# EasyEDA Pro project MPU_6050_Adapter.eprj

# Schematic Schematic1
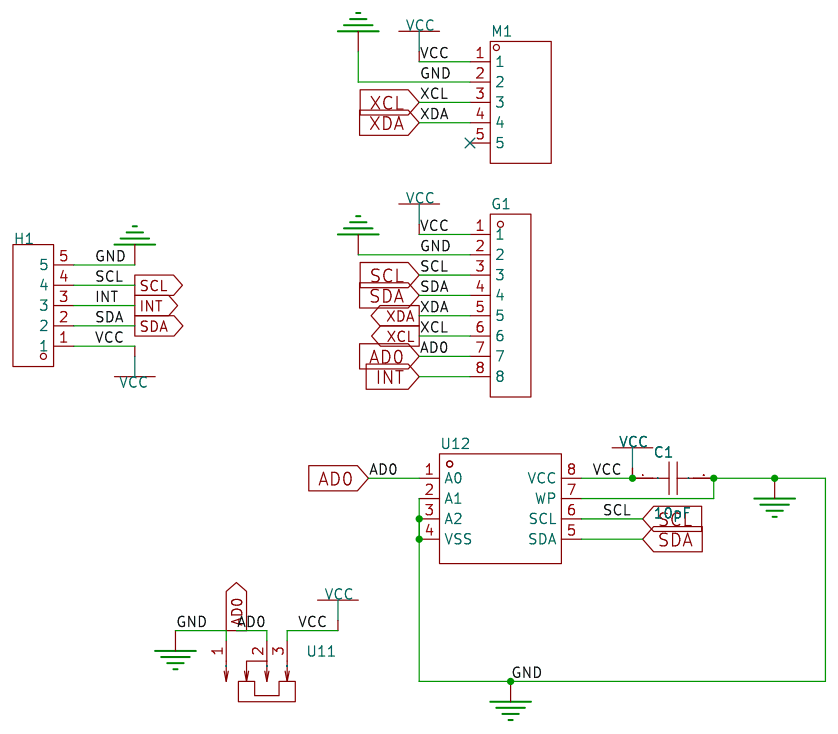
[diagram p0: schematic sheet]

## Parts
C1  10pF  [C0402]
G1  -  [MPU6050]
H1  -  [HDR-TH_5P-P2.54-V-M]
M1  -  [GY-271]  (no BOM)
U11  -  [SW-TH_SK-3260D-01-LX]
U12  -  [SOIC-8_L4.9-W3.9-P1.27-LS6.0-BL]

## Library data of the parts
C1 = CL05C100JB5NNNC: Capacitance: Tolerance: Tolerance: Voltage Rated: Temperature Coefficient:; LCSC Part Name: 10pF ±5% 50V; Supplier Part: C32949; Manufacturer: SAMSUNG(三星); Supplier Footprint: 0402; JLCPCB Part Class: Basic Part; Datasheet: https://atta.szlcsc.com/upload/public/pdf/source/20160103/1457707722238.pdf; Supplier: LCSC
G1 = MPU6050
H1 = PZ254V-11-05P: Pitch:2.54mm Number of Pins:5 Number of Rows:1 Pin Structure:1x5P Row Spacing:- Mounting Type:直插 Circluar Pins/Square Pins:方针 Current Rating (Max):- Voltage Rating (Max):- Length of Mating Pin:6mm Insulation Height:2.5mm Length of End Connection Pin:3mm C; LCSC Part Name: 2.54mm 1x5P 直插 方针; Supplier Part: C492404; Manufacturer: XFCN(兴飞); Supplier Footprint: 直插,P=2.54mm; JLCPCB Part Class: Extended Part; Datasheet: https://atta.szlcsc.com/upload/public/pdf/source/20200309/C492404_E51533260F8710EFF5D4617281164C1D.pdf; Supplier: LCSC; Pitch: 2.54mm; Number of Pins: 5; Number of Rows: 1; Pin Structure: 1x5P; Mounting Type: 直插; Circluar Pins/Square Pins: 方针; Length of Mating Pin: 6mm; Insulation Height: 2.5mm; Length of End Connection Pin: 3mm; Contact Material: 黄铜; Operating Temperature Range: -40~+105; Color: 黑色
M1 = GY-271
U11 = SK-3260D-01-L1: Current Rating (DC):50mA Voltage Rating (DC):12V Current Rating (AC):50mA Voltage Rating (AC):12V Circuit:单刀双掷 Mounting Style:卧插 Mechanical Life:10000 Actuator Color:黑色 Actuator Style:矩形柱状 Pin Style:PC引脚 Operating Temperature:-40~+85 Operating Temperatu; Supplier Part: C466004; Manufacturer: XKB Connectivity(中国星坤); Supplier Footprint: 插件; JLCPCB Part Class: Extended Part; Datasheet: https://atta.szlcsc.com/upload/public/pdf/source/20211009/221EDC0F79A971BF29F08D53B29B73D7.pdf; Supplier: LCSC; Current Rating (DC): 50mA; Voltage Rating (DC): 12V; Current Rating (AC): 50mA; Voltage Rating (AC): 12V; Circuit: 单刀双掷; Mounting Style: 卧插; Mechanical Life: 10000; Actuator Color: 黑色; Actuator Style: 矩形柱状; Pin Style: PC引脚; Operating Temperature: -40~+85; Switch Length: 9mm; Switch Width: 3.5mm; Switch Height: 3.6mm
U12 = CAT24C256WI-GT3: 存储器容量:256Kb (32K x 8);存储器接口类型:I2C;工作电压:1.8V ~ 5.5V;; Supplier Part: C79987; Manufacturer: onsemi(安森美); Supplier Footprint: SOIC-8_150mil; JLCPCB Part Class: Extended Part; Datasheet: https://atta.szlcsc.com/upload/public/pdf/source/20160729/1469779584823.PDF; Supplier: LCSC; Memory Format: EEPROM; Memory Size: 256Kb (32K x 8); Memory Interface: I2C; Voltage - Supply: 1.8V ~ 5.5V

## Nets
GND: C1.2 G1.2 H1.5 M1.2 U11.1 U12.2(A1) U12.3(A2) U12.4(VSS) U12.7(WP)
VCC: C1.1 G1.1 H1.1 M1.1 U11.3 U12.8(VCC)
AD0: G1.7 U11.2 U12.1(A0)
INT: G1.8 H1.3
SCL: G1.3 H1.4 U12.6(SCL)
SDA: G1.4 H1.2 U12.5(SDA)
XCL: G1.6 M1.3
XDA: G1.5 M1.4

Not connected (* = marked no-connect by the designer): M1 5*

# Board MPU_6050_Adapter
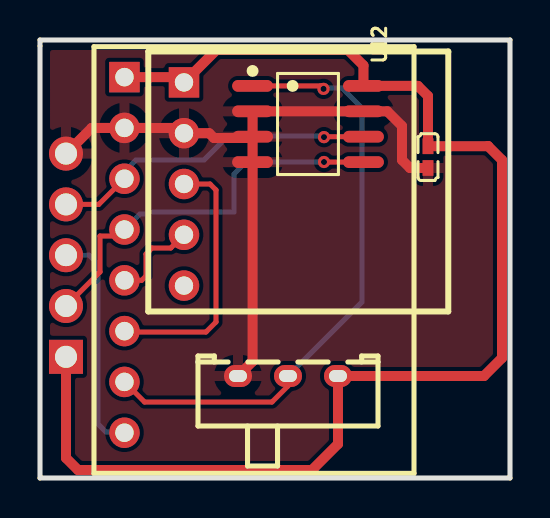
[diagram p1: board, top side]
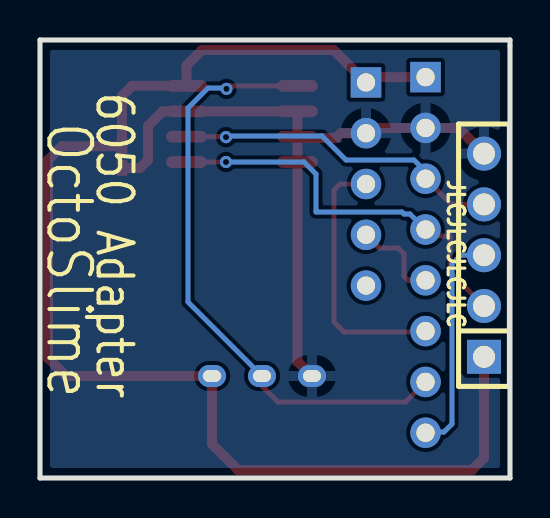
[diagram p2: board, bottom side, seen from below]

Outline 23.5 x 21.9 mm; copper layers: Top Layer, Bottom Layer. Coordinates in mm from the lower left corner of the outline.
Outline path: 0,21.6 0,21.9 23.5,21.9 23.5,0 0,0 0,21.6
Stack: Top Layer 0.035mm / Dielectric1 1.51mm FR4 er 4.5 / Bottom Layer 0.035mm

## Design rules (mm)
spacing Default (default): track to track 0.152, other pairs 0 to 0.152
spacing V/G: track to track 0.152, other pairs 0 to 0.152
track width Default (default): min 0.25, default 0.25, max 25.4
track width V/G: min 0.5, default 0.5, max 25.4
differential pair differentialPair (default): width min 0.127, default 0.254, max 2.54; gap min 0.152, default 0.152
via Default (default): diameter min 0.61, default 0.61, max 100.025; hole min 0.305, default 0.305, max 59.995
via V/G: diameter min 0.61, default 0.61, max 100.025; hole min 0.305, default 0.305, max 59.995
net GND uses V/G, gge4969

## Placement (name value [footprint] x y rotation side)
C1  10pF  [C0402]  19.4 16.05 270 top
G1  -  [MPU6050]  10.7 10.9 0 top
H1  -  [HDR-TH_5P-P2.54-V-M]  1.3 11.14 90 bottom
M1  -  [GY-271]  7.2 14.7 0 top
U11  -  [SW-TH_SK-3260D-01-LX]  12.4 5.1 0 top
U12  -  [SOIC-8_L4.9-W3.9-P1.27-LS6.0-BL]  13.4 17.7 270 top

## Footprints (pads in the part's own frame, mm; a bottom-side part is the same pattern mirrored in y, then rotated)
C0402
  rect 0.79x0.54 smd: 1(-0.545,0) 2(0.545,0)
GY-271
  rect 1.524x1.524 hole 0.914: 1(0,5.08)
  round 1.524 hole 0.914: 2(0,2.54) 3(0,0) 4(0,-2.54) 5(0,-5.08)
HDR-TH_5P-P2.54-V-M
  rect 1.7x1.7 hole 1.1: 1(-5.08,0)
  round 1.7 hole 1.1: 2(-2.54,0) 3(0,0) 4(2.54,0) 5(5.08,0)
MPU6050
  rect 1.524x1.524 hole 0.914x0.919: 1(-6.477,9.144)
  round 1.524 hole 0.914x0.919: 2(-6.477,6.604) 3(-6.477,4.064) 4(-6.477,1.524) 5(-6.477,-1.016) 6(-6.477,-3.556) 7(-6.477,-6.096) 8(-6.477,-8.636)
SOIC-8_L4.9-W3.9-P1.27-LS6.0-BL
  oval 0.59x2.045 smd: 1(-1.905,-2.771) 2(-0.635,-2.771) 3(0.635,-2.771) 4(1.905,-2.771) 5(1.905,2.773) 6(0.635,2.773) 7(-0.635,2.773) 8(-1.905,2.773)
SW-TH_SK-3260D-01-LX
  oval 1.4x1.1 hole 0.9x0.6: 1(-2.5,0) 2(0,0) 3(2.5,0)

## Nets
As in the schematic.

Pads without a net: M1 5

## Via types
v1: diameter 0.61, hole 0.305, Top Layer to Bottom Layer, 3 vias

## Routing (per net, layer and track width the routed paths; a pad name or vN(x,y) marks a point on that pad's centre or on a via; arc(x,y) is an arc through that point)
GND: length 34.6
  Top Layer w0.5: U12.3 U12.4 10.63,5.83 U11.1 ; U12.3 10.56,17 8.7,17 8.46,17.24 M1.2 6.94,17.5 G1.2 2.58,17.5 H1.5 ; U12.3 U12.2 U12.7 17.37,18.34 18.1,17.6 18.1,15.9 18.5,15.5 C1.2
VCC: length 65.3
  Top Layer w0.5: G1.1 6.94,20.04 M1.1 8.82,21.4 15.4,21.4 16.17,20.63 U12.8 18.9,19.61 19.4,19.1 C1.1 22.39,16.59 22.4,16.6 23.1,15.9 23.1,6 22.2,5.1 U11.3 14.9,1.7 13.6,0.4 1.9,0.4 1.3,1 H1.1
AD0: length 30.3
  Top Layer w0.25: G1.7 5.23,3.8 11.6,3.8 12.4,4.6 U11.2 ; U12.1 14.03,19.61 v1(14.18,19.45)
  Bottom Layer w0.25: v1(14.18,19.45) 14.22,19.5 15.1,19.5 16.1,18.5 16.1,8.8 U11.2
INT: length 11.3
  Bottom Layer w0.25: G1.8 4.19,2.3 3.3,2.3 2.9,2.7 2.9,10.7 2.46,11.14 H1.3
SCL: length 16.5
  Top Layer w0.25: H1.4 2.94,13.68 G1.3 ; U12.6 14.22,17.06 v1(14.2,17.04)
  Bottom Layer w0.25: G1.3 4.22,15.32 4.8,15.9 8.2,15.9 9.4,17.1 14.14,17.1 v1(14.2,17.04)
SDA: length 20
  Top Layer w0.25: G1.4 3.9,12.1 3,12.1 3,10.3 H1.2 ; U12.5 14.21,15.8 v1(14.2,15.8)
  Bottom Layer w0.25: v1(14.2,15.8) 10.3,15.8 9.7,15.2 9.7,13.3 5.4,13.3 5.3,13.2 5,13.2 G1.4
XCL: length 13.1
  Top Layer w0.25: M1.3 8.5,14.7 8.8,14.4 8.8,7.8 8.3,7.3 4.27,7.3 G1.6
XDA: length 4.6
  Top Layer w0.25: M1.4 6.54,11.5 5.6,11.5 5.3,11.2 5.3,10.1 5.08,9.88 G1.5

## Copper pours and planes (outline as drawn; the poured copper is in the pictures)
GND on Top Layer: -0.7,22.2 24.1,22.2 24.1,-0.6 -0.7,-0.6
GND on Bottom Layer: -1.4,22.6 24.5,22.6 24.5,-1.1 -1.4,-1.1

## Text on the board
Bottom Silkscreen Layer: JLCJLCJLCJLC | 6050 Adapter | OctoSlime
